# EAGLE design CC3D_micro (EAGLE 6.4)
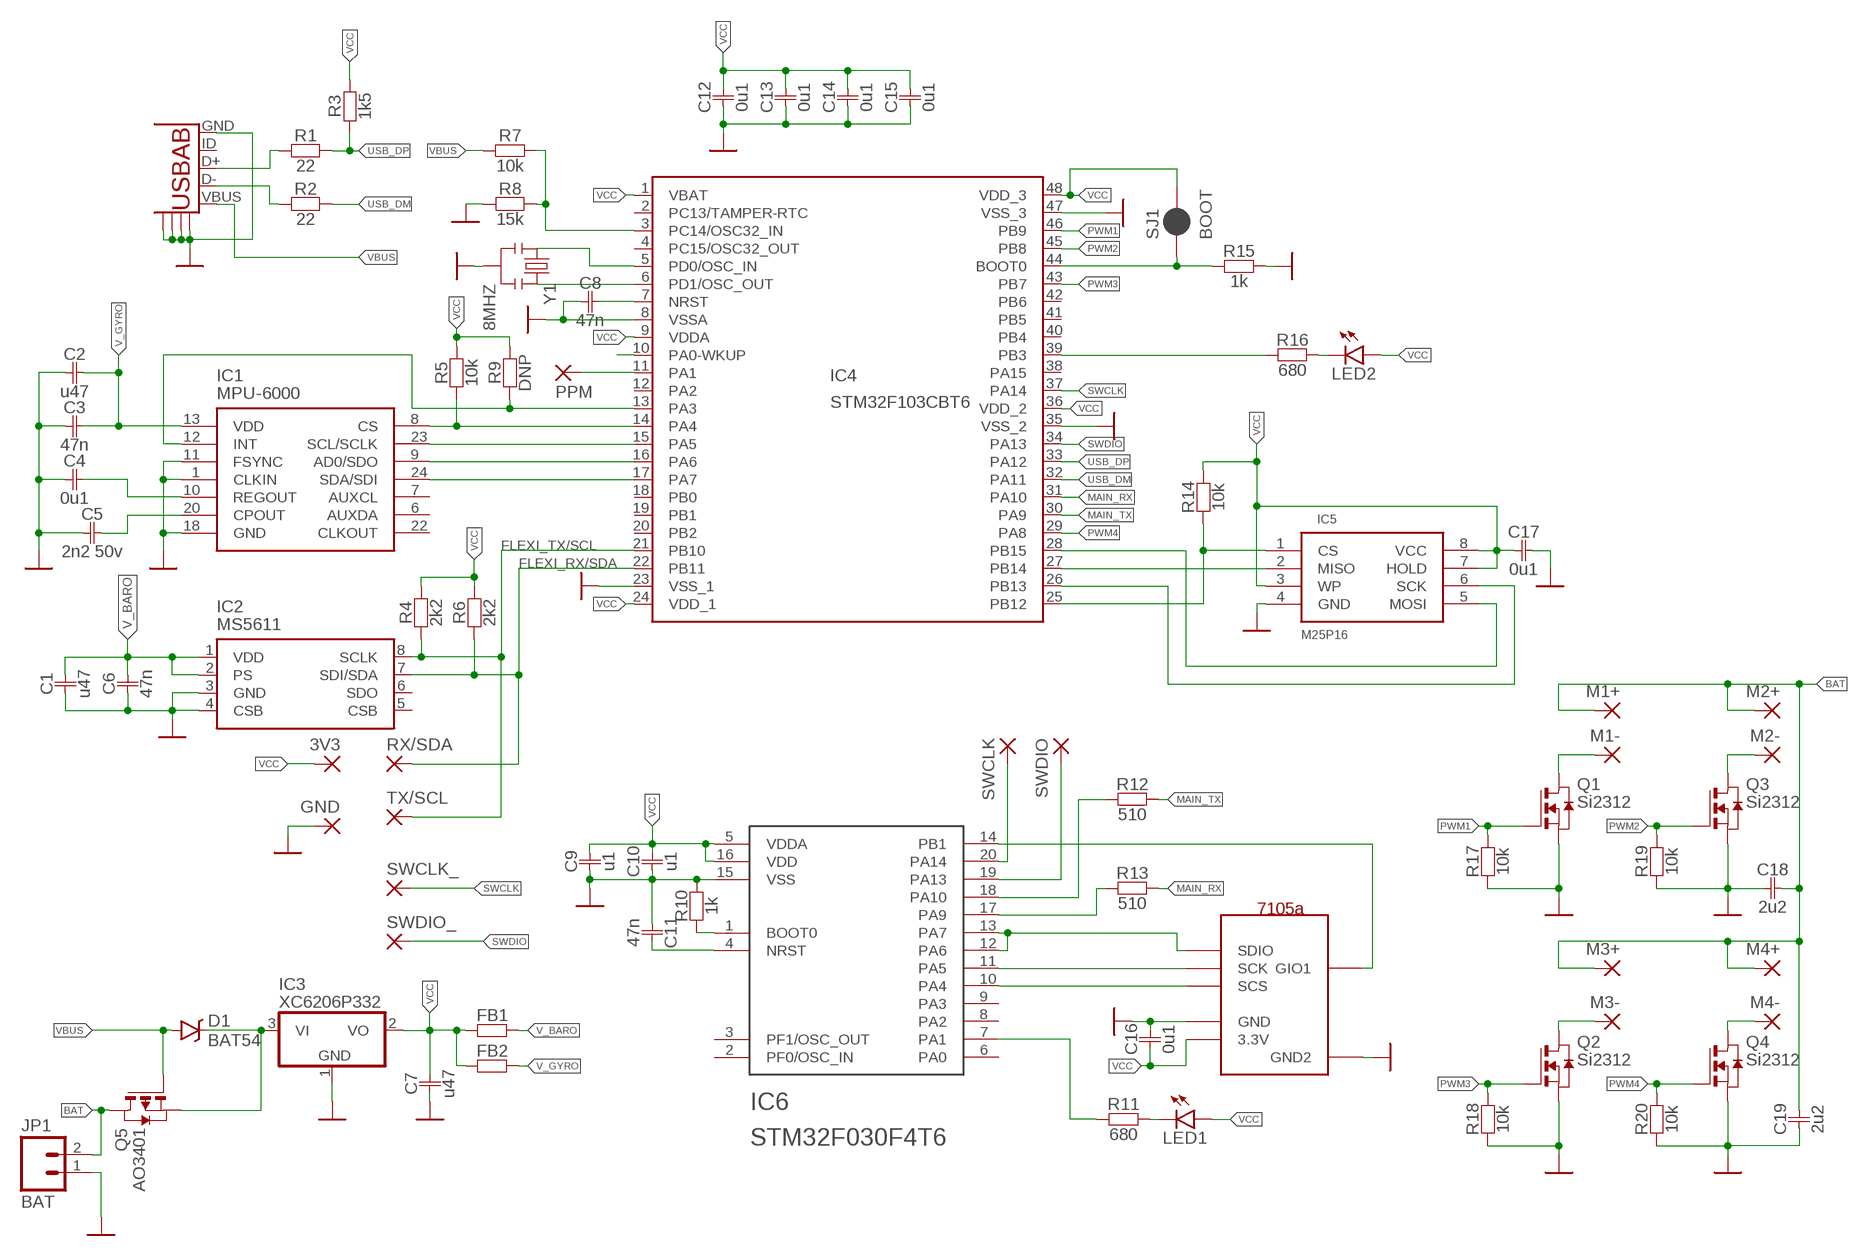
[diagram p0: schematic, sheet 1]

## Parts
3V3  SMD2  [SMD1,27-2,54]
C1  u47  C0402  [0402]
C2  u47  C0402  [0402]
C3  47n  C0402  [0402]
C4  0u1  C0402  [0402]
C5  2n2 50v  C0402  [0402]
C6  47n  C0402  [0402]
C7  u47  C0805  [0805]
C8  47n  C0402  [0402]
C9  u1  C0402  [0402]
C10  u1  C0402  [0402]
C11  47n  C0402  [0402]
C12  0u1  C0402  [0402]
C13  0u1  C0402  [0402]
C14  0u1  C0402  [0402]
C15  0u1  C0402  [0402]
C16  0u1  C0603  [0603]
C17  0u1  C0402  [0402]
C18  2u2  C0805  [0805]
C19  2u2  C0805  [0805]
D1  BAT54  BAT20JFILM  [SOD-323]
FB1  R0603  [0603]
FB2  R0603  [0603]
GND  SMD2  [SMD1,27-2,54]
IC1  MPU-6000  MPU-6050  [QFN-24-TESTING]
IC2  MS5611  [LGA8]
IC3  XC6206P332  MCP1703CB  [SOT23]
IC4  STM32F103CBT6  STM32F103C8  [LQFP48]
IC5  M25P16  SPI_FLASH-X25XXSMD  [SO08]
IC6  STM32F030F4T6  STM32F030XTSSOP20  [TSSOP-20]
JP1  BAT  M021X02_NO_SILK  [1X02_NO_SILK]
LED1  LED0603  [LED-0603]
LED2  LED0603  [LED-0603]
M1+  SMD2  [SMD1,27-2,54]
M1-  SMD2  [SMD1,27-2,54]
M2+  SMD2  [SMD1,27-2,54]
M2-  SMD2  [SMD1,27-2,54]
M3+  SMD2  [SMD1,27-2,54]
M3-  SMD2  [SMD1,27-2,54]
M4+  SMD2  [SMD1,27-2,54]
M4-  SMD2  [SMD1,27-2,54]
PPM  SMD2  [SMD1,27-2,54]
Q1  Si2312  NMOSSOT23  [SOT-23]
Q2  Si2312  NMOSSOT23  [SOT-23]
Q3  Si2312  NMOSSOT23  [SOT-23]
Q4  Si2312  NMOSSOT23  [SOT-23]
Q5  AO3401  PMOSSOT23  [SOT-23]
R1  22  R0402  [0402]
R2  22  R0402  [0402]
R3  1k5  R0402  [0402]
R4  2k2  R0402  [0402]
R5  10k  R0402  [0402]
R6  2k2  R0402  [0402]
R7  10k  R0402  [0402]
R8  15k  R0402  [0402]
R9  DNP  R0402  [0402]
R10  1k  R0402  [0402]
R11  680  R0402  [0402]
R12  510  R0402  [0402]
R13  510  R0402  [0402]
R14  10k  R0402  [0402]
R15  1k  R0402  [0402]
R16  680  R0402  [0402]
R17  10k  R0402  [0402]
R18  10k  R0402  [0402]
R19  10k  R0402  [0402]
R20  10k  R0402  [0402]
RX/SDA  SMD2  [SMD1,27-2,54]
SJ1  BOOT  JUMPER-PAD-2-NC_BY_PASTE  [PAD-JUMPER-2-NC_BY_PASTE_YES_SILK]
SWCLK  SMD2  [SMD1,27-2,54]
SWCLK_  SMD2  [SMD1,27-2,54]
SWDIO  SMD2  [SMD1,27-2,54]
SWDIO_  SMD2  [SMD1,27-2,54]
TX/SCL  SMD2  [SMD1,27-2,54]
U$1  microUSB  UNTITLED_USB_AB  [UNTITLED_USB-AB-MICRO-SMD]
U$2  XL7105-SL-B-TH  [XL7105-SY-B]
Y1  8MHZ  RESONATOR8MHZ  [RESONATOR-SMD]

## Nets
BAT: C18.P$2 C19.P$2 JP1.2 M1+.1(P) M2+.1(P) M3+.1(P) M4+.1(P) Q5.1(D)
FLEXI_RX/SDA: IC2.7(SDI/SDA) IC4.22(PB11) R6.P$1 RX/SDA.1(P)
FLEXI_TX/SCL: IC2.8(SCLK) IC4.21(PB10) R4.P$1 TX/SCL.1(P)
GND: C1.P$1 C2.P$1 C3.P$1 C4.P$1 C5.P$1 C6.P$1 C7.P$1 C8.P$1 C9.P$1 C10.P$2 C11.P$1 C12.P$1 C13.P$1 C14.P$1 C15.P$1 C16.P$2 C17.P$2 C18.P$1 C19.P$1 GND.1(P) IC1.1(CLKIN) IC1.11(FSYNC) IC1.18(GND) IC2.3(GND) IC2.4(CSB) IC3.1(GND) IC4.8(VSSA) IC4.23(VSS_1) IC4.35(VSS_2) IC4.47(VSS_3) IC5.4(GND) IC6.15(VSS) JP1.1 Q1.2(S) Q2.2(S) Q3.2(S) Q4.2(S) R8.P$2 R10.P$2 R15.P$2 R17.P$1 R18.P$1 R19.P$1 R20.P$1 U$1.GND U$1.GND@1 U$1.GND@2 U$1.GND@3 U$1.GND@4 U$2.P$2(GND) U$2.P$6(GND2) Y1.2
M1+: M1-.1(P) Q1.1(D)
M2+: M2-.1(P) Q3.1(D)
M3+: M3-.1(P) Q2.1(D)
M4+: M4-.1(P) Q4.1(D)
MAIN_RX: IC4.31(PA10) R13.P$2
MAIN_TX: IC4.30(PA9) R12.P$2
N$1: IC1.12(INT) IC4.13(PA3) R9.P$1
N$2: IC1.8(CS) IC4.14(PA4) R5.P$1
N$3: IC1.23(SCL/SCLK) IC4.15(PA5)
N$4: IC1.9(AD0/SDO) IC4.16(PA6)
N$5: IC1.24(SDA/SDI) IC4.17(PA7)
N$6: IC4.10(PA0-WKUP)
N$7: IC6.1(BOOT0) R10.P$1
N$9: IC4.25(PB12) IC5.1(CS) R14.P$1
N$10: IC4.26(PB13) IC5.6(SCK)
N$11: IC4.27(PB14) IC5.2(MISO)
N$12: IC4.28(PB15) IC5.5(MOSI)
N$13: IC4.6(PD1/OSC_OUT) Y1.3
N$14: IC6.14(PB1) U$2.P$7(GIO1)
N$15: IC4.39(PB3) R16.P$1
N$16: LED2.C R16.P$2
N$17: IC4.3(PC14/OSC32_IN) R7.P$2 R8.P$1
N$18: R2.P$2 U$1.D-
N$19: IC4.44(BOOT0) R15.P$1 SJ1.1
N$20: R1.P$2 U$1.D+
N$21: IC6.10(PA4) U$2.P$3(SCS)
N$22: IC6.11(PA5) U$2.P$4(SCK)
N$24: LED1.C R11.P$2
N$25: IC6.12(PA6) IC6.13(PA7) U$2.P$5(SDIO)
N$26: IC6.17(PA9) R13.P$1
N$27: IC6.18(PA10) R12.P$1
N$29: IC6.19(PA13) SWDIO.1(P)
N$30: IC6.20(PA14) SWCLK.1(P)
N$31: IC6.7(PA1) R11.P$1
N$32: C4.P$2 IC1.10(REGOUT)
N$33: IC4.5(PD0/OSC_IN) Y1.1
N$34: C5.P$2 IC1.20(CPOUT)
N$35: IC4.11(PA1) PPM.1(P)
N$36: D1.C IC3.3(VI) Q5.2(S)
N$37: C8.P$2 IC4.7(NRST)
N$38: C11.P$2 IC6.4(NRST)
PWM1: IC4.46(PB9) Q1.3(G) R17.P$2
PWM2: IC4.45(PB8) Q3.3(G) R19.P$2
PWM3: IC4.43(PB7) Q2.3(G) R18.P$2
PWM4: IC4.29(PA8) Q4.3(G) R20.P$2
SWCLK: IC4.37(PA14) SWCLK_.1(P)
SWDIO: IC4.34(PA13) SWDIO_.1(P)
USB_DM: IC4.32(PA11) R2.P$1
USB_DP: IC4.33(PA12) R1.P$1 R3.P$2
V_BARO: C1.P$2 C6.P$2 FB1.P$2 IC2.1(VDD) IC2.2(PS)
V_GYRO: C2.P$2 C3.P$2 FB2.P$2 IC1.13(VDD)
VBUS: D1.A Q5.3(G) R7.P$1 U$1.VBUS
VCC: 3V3.1(P) C7.P$2 C9.P$2 C10.P$1 C12.P$2 C13.P$2 C14.P$2 C15.P$2 C16.P$1 C17.P$1 FB1.P$1 FB2.P$1 IC3.2(VO) IC4.1(VBAT) IC4.9(VDDA) IC4.24(VDD_1) IC4.36(VDD_2) IC4.48(VDD_3) IC5.3(WP) IC5.7(HOLD) IC5.8(VCC) IC6.5(VDDA) IC6.16(VDD) LED1.A LED2.A R3.P$1 R4.P$2 R5.P$2 R6.P$2 R9.P$2 R14.P$2 SJ1.2 U$2.P$1(3.3V)
Unconnected: IC1.6(AUXDA) IC1.7(AUXCL) IC1.22(CLKOUT) IC2.5(CSB) IC2.6(SDO) IC4.2(PC13/TAMPER-RTC) IC4.4(PC15/OSC32_OUT) IC4.12(PA2) IC4.18(PB0) IC4.19(PB1) IC4.20(PB2) IC4.38(PA15) IC4.40(PB4) IC4.41(PB5) IC4.42(PB6) IC6.2(PF0/OSC_IN) IC6.3(PF1/OSC_OUT) IC6.6(PA0) IC6.8(PA2) IC6.9(PA3) U$1.ID(USBID)

## Library data of the parts
3V3 GND M1+ M1- M2+ M2- M3+ M3- M4+ M4- PPM RX/SDA SWCLK SWCLK_ SWDIO SWDIO_ TX/SCL = cc3d:SMD2: SMD PAD
C1-C19 = RC.v2:C
D1 = SparkFun-DiscreteSemi:BAT20JFILM: 23V, 1A Schottky diode, SOD-323 package; PROD_ID: DIO-11623; VALUE: BAT20JFILM
FB1 FB2 R1-R20 = RC.v2:R
IC1 = cc3d:MPU-6050: MPU-6000 - I2C address is 0x68 with AD0 low and 0x69 with AD0 high.
IC2 = cc3d:MS5611: edit this description Auto generated by make-symbol-device-package-bsdl.ulp Rev. 43 Source:
IC3 = semi:MCP1703: 250 mA, 16V, Low Quiescent Current LDO Regulator Source: http://ww1.microchip.com/downloads/en/DeviceDoc/22049b.pdf
IC4 = cc3d:STM32F103C8: STM32F103C8 edit this description Auto generated by make-symbol-device-package-bsdl.ulp Rev. 43 Source: STM32F103C8.txt
IC5 = cc3d:SPI_FLASH-X25XX: 8pin SPI Flash series x25xx. Works with devices like W25X32 and BR25L32
IC6 = stm32f030x:STM32F030X
JP1 = SparkFun-Connectors:M02: Standard 2-pin 0.1" header. Use with - straight break away headers ( PRT-00116) - right angle break away headers (PRT-00553) - swiss pins (PRT-00743) - machine pins (PRT-00117) - female headers (PRT-00115) Molex polarized connector foot print use with: PRT-08233 with associated crimp pins and housings. 2.54_SCREWTERM for use with PRT-10571. 3.5mm Screw Terminal footprints for PRT-08084 5mm Screw Terminal footprints for use with PRT-08432
LED1 LED2 = SparkFun-LED:LED: LEDs Standard schematic elements and footprints for 5mm, 3mm, 1206, and 0603 sized LEDs. 5mm - Spark Fun Electronics SKU : COM-00529 (and others)
Q1-Q4 = cc3d:NMOSSOT23: MOS FET; OC_FARNELL: unknown; OC_NEWARK: unknown
Q5 = cc3d:PMOSSOT23: MOS FET; OC_FARNELL: unknown; OC_NEWARK: unknown
SJ1 = SparkFun-Passives:JUMPER-PAD-2-NC_BY_PASTE
U$1 = cc3d:UNTITLED_USB_AB: This is a USB AB connector that is compatible with USB OTG. i.e. this connector can serve as a host or device
U$2 = xl7105:XL7105-SL-B
Y1 = cc3d:RESONATOR: Resonator Small SMD resonator. Used, eg, on the Arduino Pro/ Pro Mini boards. 8MHz- XTAL-08895 16MHz- XTAL-08900; PROD_ID: XTAL-08895

## Board
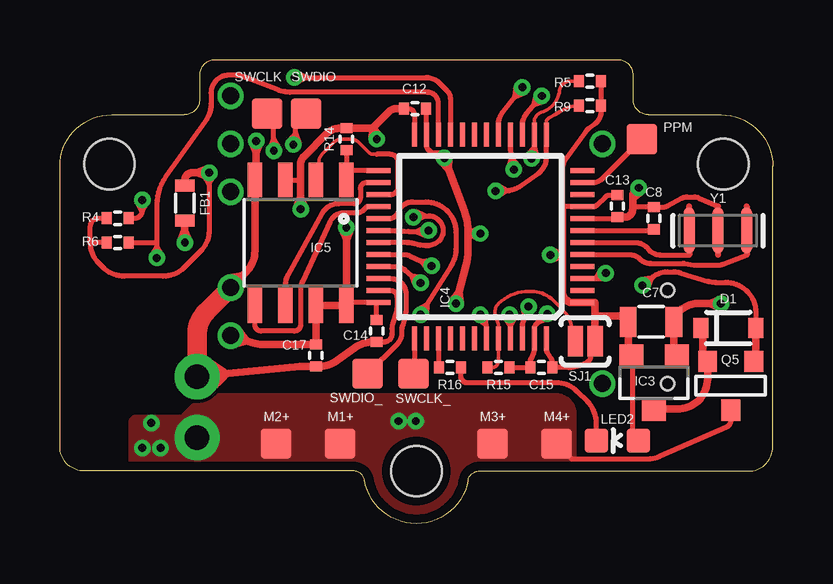
[diagram p1: board, top side]
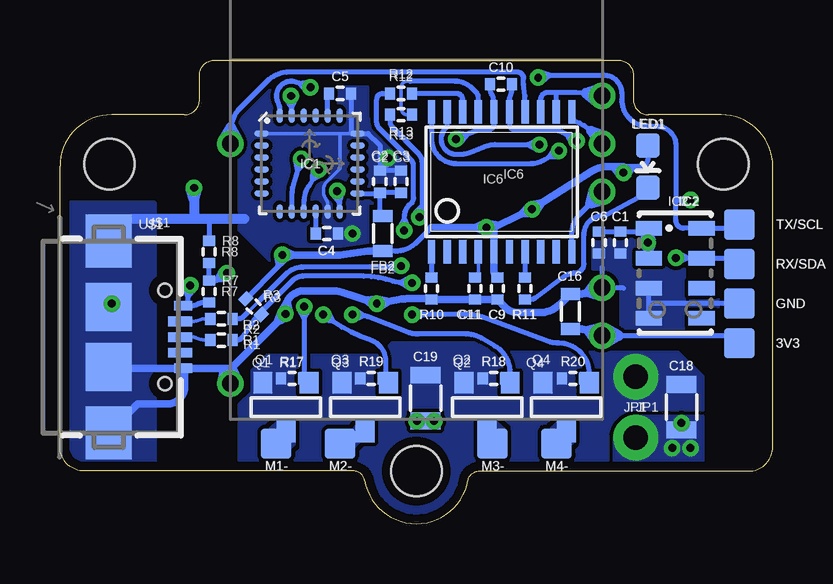
[diagram p2: board, bottom side, seen from below]

Size 29.72 x 19.34 mm. Coordinates in mm from the lower left corner, seen from the top.
Outline: 24.54,17.05 arc-90 23.9,17.69 23.9,18.7 arc90 23.27,19.34 6.45,19.34 arc90 5.82,18.7 5.82,17.69 arc-90 5.18,17.05 2.15,17.05 arc90 0,14.9 0,3.21 arc90 1.02,2.19 12.19,2.19 arc-86 12.7,1.81 arc160 17.02,1.81 arc-86 17.53,2.19 28.7,2.19 arc90 29.72,3.21 29.72,14.9 arc90 27.57,17.05 24.54,17.05
Copper layers (1*16): Top 0.0356mm / dielectric 1.5011mm / Bottom 0.0356mm
Design rules "oshpark-2layer": minimum track width 6mil, minimum drill 13mil, track to track 6mil, track to pad 6mil, pad to pad 6mil, via to via 6mil, smd to smd 6mil, copper to edge 15mil, drill to drill 6mil, minimum pad ring 7mil, minimum via ring 7mil, stop-mask expansion 0mil, vias tented up to drill 30mil, thermal gap 10mil
Holes 2.1 mm at 2.06,14.99 27.66,14.99 14.86,2.19
bRestrict: 2 lines

### Footprints (pad centres in the part's own frame; a part is rotated, then mirrored left to right if it is on the bottom)
SMD1,27-2,54 = smd 1.27 x 1.27: 1 0,0
0402 = smd 0.42 x 0.5: P$1 -0.46,0; P$2 0.46,0
0805 = smd 0.7 x 1.25: P$1 -0.95,0; P$2 0.95,0
0603 = smd 0.5 x 0.8: P$1 -0.735,0; P$2 0.735,0
SOD-323 = smd 0.63 x 0.83: A 1.15,0; C -1.15,0
QFN-24-TESTING = smd 0.61 x 0.254: 1 -2,1.25; 2 -2,0.75; 3 -2,0.25; 4 -2,-0.25; 5 -2,-0.75; 6 -2,-1.25; 13 2,-1.25; 14 2,-0.75; 15 2,-0.25; 16 2,0.25; 17 2,0.75; 18 2,1.25 | smd 0.254 x 0.61: 7 -1.25,-2; 8 -0.75,-2; 9 -0.25,-2; 10 0.25,-2; 11 0.75,-2; 12 1.25,-2; 19 1.25,2; 20 0.75,2; 21 0.25,2; 22 -0.25,2; 23 -0.75,2; 24 -1.25,2
LGA8 = smd 1.1 x 0.6: 1 -1.1,1.875; 2 -1.1,0.625; 3 -1.1,-0.625; 4 -1.1,-1.875; 5 1.1,-1.875; 6 1.1,-0.625; 7 1.1,0.625; 8 1.1,1.875
SOT23 = smd 1 x 1: 1 -0.95,-1.1; 2 0.95,-1.1; 3 0,1.1
LQFP48 = smd 0.2 x 1: 1 -2.75,-4.25; 2 -2.25,-4.25; 3 -1.75,-4.25; 4 -1.25,-4.25; 5 -0.75,-4.25; 6 -0.25,-4.25; 7 0.25,-4.25; 8 0.75,-4.25; 9 1.25,-4.25; 10 1.75,-4.25; 11 2.25,-4.25; 12 2.75,-4.25; 25 2.75,4.25; 26 2.25,4.25; 27 1.75,4.25; 28 1.25,4.25; 29 0.75,4.25; 30 0.25,4.25; 31 -0.25,4.25; 32 -0.75,4.25; 33 -1.25,4.25; 34 -1.75,4.25; 35 -2.25,4.25; 36 -2.75,4.25 | smd 1 x 0.2: 13 4.25,-2.75; 14 4.25,-2.25; 15 4.25,-1.75; 16 4.25,-1.25; 17 4.25,-0.75; 18 4.25,-0.25; 19 4.25,0.25; 20 4.25,0.75; 21 4.25,1.25; 22 4.25,1.75; 23 4.25,2.25; 24 4.25,2.75; 37 -4.25,2.75; 38 -4.25,2.25; 39 -4.25,1.75; 40 -4.25,1.25; 41 -4.25,0.75; 42 -4.25,0.25; 43 -4.25,-0.25; 44 -4.25,-0.75; 45 -4.25,-1.25; 46 -4.25,-1.75; 47 -4.25,-2.25; 48 -4.25,-2.75
SO08 = smd 0.61 x 1.448: 1 -1.905,-2.616; 2 -0.635,-2.616; 3 0.635,-2.616; 4 1.905,-2.616; 5 1.905,2.616; 6 0.635,2.616; 7 -0.635,2.616; 8 -1.905,2.616
TSSOP-20 = smd 0.305 x 0.991: 1 -2.925,-2.918; 2 -2.275,-2.918; 3 -1.625,-2.918; 4 -0.975,-2.918; 5 -0.325,-2.918; 6 0.325,-2.918; 7 0.975,-2.918; 8 1.625,-2.918; 9 2.275,-2.918; 10 2.925,-2.918; 11 2.925,2.918; 12 2.275,2.918; 13 1.625,2.918; 14 0.975,2.918; 15 0.325,2.918; 16 -0.325,2.918; 17 -0.975,2.918; 18 -1.625,2.918; 19 -2.275,2.918; 20 -2.925,2.918
1X02_NO_SILK = drill 1.016 pad 1.88: 1 0,0; 2 2.54,0
LED-0603 = smd 1 x 1: A 0,-0.877; C 0,0.877
SOT-23 = smd 0.787 x 0.889: 1 0.025,-1.016; 2 -0.94,1.016; 3 0.991,1.016
PAD-JUMPER-2-NC_BY_PASTE_YES_SILK = smd 0.635 x 1.27: 1 -0.401,0; 2 0.413,0
UNTITLED_USB-AB-MICRO-SMD = smd 1 x 0.4: D+ 2.469,0; D- 2.469,0.65; ID 2.469,-0.65 | smd 0.746 x 0.4: GND 2.596,-1.3; VBUS 2.596,1.3 | smd 1.9 x 2.2: GND@1 -0.508,4; GND@4 -0.508,-4 | smd 1.9 x 2: GND@2 -0.508,1.25; GND@3 -0.508,-1.25 | hole 0.55: 1.84,1.95; 1.84,-1.95
XL7105-SY-B = drill 0.7 pad 1.1: P$1 8,-4; P$2 8,-2; P$3 8,2; P$4 8,4; P$5 8,6; P$6 -7.5,-6; P$7 -7.5,4
RESONATOR-SMD = smd 0.45 x 1.905: 1 -1.2,0; 2 0,0; 3 1.2,0

### Placement (x,y rotation side)
3V3  1.4,7.53 90 bottom
C1  6.35,11.72 90 bottom
C2  16.38,14.26 270 bottom
C3  15.49,14.26 270 bottom
C4  18.59,12.1 180 bottom
C5  18.03,17.94 180 bottom
C6  7.24,11.72 90 bottom
C7  24.64,8.42 180 top
C8  24.77,12.73 270 top
C9  11.48,9.81 90 bottom
C10  11.33,18.32 0 bottom
C11  12.42,9.81 90 bottom
C12  14.81,17.31 180 top
C13  23.24,13.24 90 top
C14  13.21,8.03 90 top
C15  20.07,6.51 0 top
C16  8.43,8.85 90 bottom
C17  10.67,7.02 270 top
C18  3.81,4.86 270 bottom
C19  14.48,5.24 270 bottom
D1  27.86,8.16 0 top
FB1  5.21,13.37 270 top
FB2  16.26,12.1 90 bottom
GND  1.4,9.18 90 bottom
IC1  19.3,15.02 0 bottom
IC2  4.06,10.45 0 bottom
IC3  24.77,5.88 180 top
IC4  17.53,11.97 90 top
IC5  10.03,11.72 180 top
IC6  11.3,14.26 0 bottom
JP1  5.71,6.13 270 bottom
LED1  5.21,14.89 180 bottom
LED2  23.24,3.46 90 top
M1+  11.68,3.34 180 top
M1-  20.7,3.34 270 bottom
M2+  9.02,3.34 0 top
M2-  18.03,3.34 0 bottom
M3+  18.03,3.34 90 top
M3-  11.68,3.34 180 bottom
M4+  20.7,3.34 0 top
M4-  9.02,3.34 0 bottom
PPM  24.26,16.04 0 top
Q1  20.32,4.86 0 bottom
Q2  11.94,4.86 0 bottom
Q3  17.02,4.86 0 bottom
Q4  8.64,4.86 0 bottom
Q5  27.94,5.75 0 top
R1  22.99,7.65 180 bottom
R2  22.99,8.54 180 bottom
R3  21.64,9.05 315 bottom
R4  2.41,12.73 180 top
R5  22.1,18.45 0 top
R6  2.41,11.72 180 top
R7  23.49,9.69 90 bottom
R8  23.49,11.34 90 bottom
R9  22.1,17.43 0 top
R10  14.22,9.81 270 bottom
R11  10.34,9.81 270 bottom
R12  15.49,17.94 180 bottom
R13  15.49,17.05 180 bottom
R14  11.94,16.04 90 top
R15  18.29,6.51 0 top
R16  16.26,6.51 0 top
R17  20.04,6.05 0 bottom
R18  11.63,6.05 0 bottom
R19  16.74,6.05 0 bottom
R20  8.33,6.05 0 bottom
RX/SDA  1.4,10.83 90 bottom
SJ1  21.89,7.6 0 top
SWCLK  8.64,17.1 90 top
SWCLK_  14.73,6.26 0 top
SWDIO  10.26,17.1 90 top
SWDIO_  12.83,6.26 0 top
TX/SCL  1.4,12.48 90 bottom
U$1  27.18,7.78 0 bottom
U$2  15.11,11.84 0 bottom
Y1  27.43,12.23 180 top

### Tracks (layer width: path | path; a pad name or v marks a point on that pad's centre or on a via)
BAT  (via drill 0.33 pad 0.69)
  Top 0.203: M4+.1 21.34,2.7 24.5,2.7 arc24 25.01,2.81 27.78,4.02 arc67 27.97,4.31 Q5.1
  Bottom 0.152: v14.83,4.28 14.62,4.28 | 14.62,4.28 C19.P$2 | 14.62,4.28 14.26,4.5 v14.12,4.28 14.27,4.05 14.62,4.28
  other vias: 3.43,3.16 4.19,3.16 3.81,4.2
  pour Bottom (no thermals): 5.71,4.48 2.92,4.48 2.92,2.32 6.6,2.32 6.6,3.59
  pour Top (rank 2, no thermals): 21.46,2.19 21.46,4.61 arc90 20.7,5.37 5.97,5.37 5.08,4.48 3.18,4.48 arc90 2.92,4.22 2.92,2.19 11.68,2.19 13.84,0.03 15.88,0.03 18.03,2.19
FLEXI_RX/SDA  (via drill 0.33 pad 0.69)
  Top 0.203: IC4.22 15.78,17.53 arc90 15.32,17.99 9.58,17.99 arc-21 9.13,18.08 7.71,18.62 arc21 7.26,18.7 7.04,18.7 arc90 6.3,17.97 6.3,17.51 arc-36 6.06,16.77 4.41,14.48 arc36 4.04,13.31 4.04,11.72 | R6.P$1 4.04,11.72 | 4.04,11.72 4.04,11.58 | 4.04,11.58 v4.04,11.08 | 4.04,11.58 3.83,11.2 v4.04,11.08 | 4.04,11.58 4.25,11.2 v4.04,11.08
  Bottom 0.203: RX/SDA.1 1.64,11.07 IC2.7 3.54,11.07 | 3.54,11.07 v4.03,11.07 v4.04,11.08 | 3.54,11.07 3.93,10.87 v4.04,11.08 | 3.54,11.07 3.92,11.29 v4.04,11.08
FLEXI_TX/SCL  (via drill 0.33, 0.33 pad 0.69)
  Top 0.203: v9.78,18.6 10.27,18.6 | 10.27,18.6 15.28,18.6 arc-45 15.82,18.38 16.14,18.05 arc-45 16.28,17.73 IC4.21 | R4.P$1 3.11,12.73 arc81 3.43,13 | 3.43,13 arc9 3.43,13.05 v3.43,13.5 | 10.27,18.6 9.9,18.81 v9.78,18.6 | 10.27,18.6 9.9,18.39 v9.78,18.6 | 3.43,13 3.64,13.38 v3.43,13.5 | 3.43,13 3.22,13.38 v3.43,13.5
  Bottom 0.203: v9.78,18.6 9.75,18.6 9.65,18.7 9.29,18.7 | 9.29,18.7 7.04,18.7 arc90 6.3,17.97 6.3,17.69 arc-91 5.16,16.57 4.83,16.57 arc90 4.04,15.78 4.04,13.5 | 4.04,13.5 4.04,12.64 arc-90 3.72,12.32 IC2.8 1.55,12.32 TX/SCL.1 | 4.04,13.5 3.92,13.5 | 3.92,13.5 v3.43,13.5 | 9.29,18.7 9.62,18.42 v9.78,18.6 | 9.29,18.7 9.71,18.83 v9.78,18.6 | 3.92,13.5 3.55,13.71 v3.43,13.5 | 3.92,13.5 3.55,13.28 v3.43,13.5
GND  (via drill 0.33 pad 0.69)
  Top 0.203: C12.P$1 IC4.23 15.28,15.78 arc64 15.42,15.55 15.58,15.47 | 8.18,14.33 IC5.4 | IC4.35 13.79,9.72 arc-90 14.05,9.47 14.05,8.97 arc-18 14.02,8.78 13.87,8.33 arc18 13.84,8.14 13.84,7.91 arc-45 13.75,7.69 13.73,7.67 arc-45 13.5,7.57 C14.P$1 | R15.P$2 C15.P$1 19.61,6.74 arc-24 19.63,6.88 19.75,7.12 arc24 19.78,7.25 IC4.47 19.78,8.11 arc-48 19.88,8.35 19.95,8.41 | IC4.8 23.37,12.72 C13.P$1 | 19.95,8.41 v20.32,8.75 | 15.58,15.47 v16.03,15.25 | 27.43,13.24 26.63,13.59 arc23 26.45,13.62 26.15,13.62 arc28 25.94,13.57 25.32,13.25 arc-28 25.11,13.19 C8.P$1 23.92,13.19 23.88,13.24 | 19.95,8.41 20.32,8.56 v20.32,8.75 | 19.95,8.41 20.09,8.82 v20.32,8.75 | 15.58,15.47 15.83,15.11 v16.03,15.25 | 15.58,15.47 16.02,15.46 v16.03,15.25
  Top 0.305: v8.18,15.96 8.18,15.46 | 8.18,15.46 8.18,14.33 | IC5.4 8.13,11.39 arc-45 7.76,10.49 7.61,10.34 | 7.61,10.34 U$2.P$2 | C13.P$1 23.56,12.78 arc90 23.88,13.1 23.88,13.24 23.88,13.58 | 23.88,13.58 23.88,13.75 v24.13,14 | IC3.1 25.59,6.98 C7.P$1 25.59,8.6 25.87,8.88 arc-45 26.58,9.18 27.06,9.18 | v16.51,9.18 16.93,10.77 arc15 17.02,11.41 17.02,12.1 | 17.02,12.1 17.02,12.15 arc21 16.86,13.03 v16.03,15.25 | 17.02,12.1 17.03,12.1 | 17.03,12.1 v17.53,12.1 | 27.06,9.18 v27.56,9.18 | C14.P$1 13.03,7.57 arc36 12.29,7.33 11.56,6.8 arc-36 10.81,6.56 C17.P$2 10.14,6.56 arc6 10.02,6.55 JP1.1 | 8.18,15.46 8.33,15.89 v8.18,15.96 | 8.18,15.46 8,15.89 v8.18,15.96 | 23.88,13.58 24.24,13.85 v24.13,14 | 23.88,13.58 23.94,14.03 v24.13,14 | v16.03,15.25 16.22,15.24 16.2,14.78 15.89,15.12 v16.03,15.25 | v16.51,9.18 16.36,9.29 16.64,9.66 16.7,9.2 v16.51,9.18 | 17.03,12.1 17.45,11.92 v17.53,12.1 | 17.03,12.1 17.45,12.27 v17.53,12.1 | 27.06,9.18 27.49,9 v27.56,9.18 | 27.06,9.18 27.49,9.35 v27.56,9.18 | 7.61,10.34 7.04,10.24 U$2.P$2 | 7.61,10.34 7.5,9.77 U$2.P$2
  Top 0.61: 6.73,6.23 6.06,6.66 JP1.1 6.16,5.67 6.73,6.23
  Top 0.813: JP1.1 5.71,7.92 arc-45 6.09,8.82 U$2.P$2
  Bottom 0.152: 17.57,16.27 18.03,16.27 | 18.03,16.27 18.03,14.82 18.57,14.28 arc-73 18.67,13.6 18.55,13.41 IC1.11 | IC1.1 18.03,16.27
  Bottom 0.203: 8.59,16.23 8.64,16.26 arc-33 9.18,16.42 10.72,16.42 arc90 10.98,16.67 IC6.15 10.98,17.63 arc23 10.93,17.88 10.92,17.9 arc-23 10.87,18.15 C10.P$2 | 8.59,16.23 v8.18,15.96 | C5.P$1 17.57,16.27 IC1.18 16.87,16.27 16.38,15.78 C2.P$1 | C3.P$1 C2.P$1 | IC2.4 5.16,9.18 | 5.16,9.18 IC2.3 | GND.1 5.16,9.18 | 23.49,12.72 R8.P$2 | 7.11,10.7 U$2.P$2 6.26,9.84 6.22,9.81 | v16.03,15.25 16.08,15.02 16.28,14.82 | 16.28,14.82 C2.P$1 | 8.59,16.23 8.16,16.2 v8.18,15.96 | 8.59,16.23 8.39,15.85 v8.18,15.96 | 16.28,14.82 16.27,15.25 v16.03,15.25 | 16.28,14.82 15.91,15.04 v16.03,15.25
  Bottom 0.305: 7.78,9.62 arc18 8.01,9.58 C16.P$2 8.85,9.17 arc45 9.75,8.8 10.61,8.8 arc45 11.15,9.02 C9.P$1 C11.P$1 R10.P$2 14.23,9.38 15.26,9.38 arc-10 15.48,9.36 16.02,9.26 | 7.78,9.62 arc-1 7.76,9.62 U$2.P$2 | U$1.GND@3 27.69,6.48 U$1.GND 22.91,6.48 | 22.91,6.48 22.59,6.48 | 22.59,6.48 22.53,6.54 | 22.53,6.54 20.67,8.4 | 20.67,8.4 v20.32,8.75 | U$2.P$6 22.61,6.45 22.59,6.48 | U$1.GND@1 26.74,12.72 | v20.32,8.75 20.32,8.92 arc90 19.53,9.71 18.38,9.71 arc18 18,9.65 v16.51,9.18 | v27.56,9.18 27.54,9.18 U$1.GND@2 | U$1.GND@4 26.48,4.99 25.27,4.99 arc-90 24.51,5.75 24.51,6.51 | v16.51,9.18 16.02,9.26 | 20.67,8.4 20.5,8.82 v20.32,8.75 | 20.67,8.4 20.25,8.57 v20.32,8.75 | v20.32,8.75 20.14,8.8 20.25,9.24 20.48,8.84 v20.32,8.75 | v16.51,9.18 16.53,9.37 16.98,9.33 16.63,9.03 v16.51,9.18 | 16.02,9.26 16.41,9.02 v16.51,9.18 | 16.02,9.26 16.47,9.36 v16.51,9.18 | 22.91,6.48 22.41,6.19 U$2.P$6 | 22.91,6.48 23.01,5.91 U$2.P$6 | 22.53,6.54 22.26,6.03 U$2.P$6 | 22.53,6.54 22.91,6.11 U$2.P$6 | 7.78,9.62 7.43,10.08 U$2.P$2 | 7.78,9.62 7.22,9.46 U$2.P$2
  Bottom 0.406: 26.74,12.72 24.13,12.72 | 24.13,12.72 23.49,12.72 22.03,12.72 | v24.13,14 24.13,13.51 | 24.13,13.51 24.13,12.72 | 24.13,13.51 24.26,13.96 v24.13,14 | 24.13,13.51 24,13.96 v24.13,14 | U$2.P$2 6.81,10.02 | U$2.P$2 7.41,10.02 | U$2.P$2 6.94,9.54 | U$2.P$2 6.94,10.15
  pour Bottom (rank 2, no thermals): 2.92,4.73 5.71,4.73 6.86,3.59 6.86,2.32 6.99,2.19 11.68,2.19 14.1,-0.22 15.62,-0.22 18.03,2.19 22.23,2.19 22.23,4.99 21.72,5.49 21.72,6.38 21.08,7.02 16.38,7.02 15.88,7.53 11.68,7.53 11.3,7.15 3.94,7.15 2.92,6.13
  pour Bottom (no thermals): 16.89,18.19 20.83,18.19 22.23,16.8 22.23,12.23 20.95,10.96 16.89,10.96 16.89,13.37 14.99,13.37 14.99,15.02 16.89,16.92
  pour Bottom (no thermals): 2.29,12.99 7.49,12.99 7.49,10.63 7.09,10.63 arc90 6.32,9.86 6.32,8.03 2.29,8.03
  pour Bottom (no thermals): 30.61,13.37 25.78,13.37 25.78,2.32 30.61,2.32
M1+
  pour Bottom (no thermals): 20.95,3.95 20.68,4.22 19.96,4.22 19.96,3.31 20.12,3.16 20.95,3.16
M2+
  pour Bottom (no thermals): 18.16,3.89 17.53,3.89 17.32,4.1 16.69,4.1 16.69,3.49 17.17,3.49 17.45,3.21 18.16,3.21
M3+
  pour Bottom (no thermals): 12.24,4.2 11.51,4.2 11.15,3.89 11.15,3.21 12.24,3.21
M4+
  pour Bottom (no thermals): 8.97,4.22 9.32,3.89 9.5,3.89 9.5,3.18 8.53,3.18 8.31,3.41 8.31,4.22
MAIN_RX  (via drill 0.33 pad 0.69)
  Top 0.203: v14.73,12.78 14.78,12.84 15.22,12.84 | 15.22,12.84 15.37,12.84 arc-155 15.62,11.67 arc-26 15.24,11.59 arc-16 14.81,11.67 arc19 14.48,11.72 arc-2 IC4.31 | 15.22,12.84 14.83,13.01 v14.73,12.78 | 15.22,12.84 14.79,12.61 v14.73,12.78
  Bottom 0.203: R13.P$2 15.95,16.75 arc-45 15.86,16.53 14.79,15.46 arc45 14.61,15.01 14.61,13.26 | 14.61,13.26 14.61,12.78 v14.73,12.78 | 14.61,13.26 14.5,12.84 v14.73,12.78 | 14.61,13.26 14.91,12.95 v14.73,12.78
MAIN_TX  (via drill 0.33 pad 0.69)
  Top 0.203: IC4.30 13.97,12.22 arc-6 14.35,12.2 arc8 14.87,12.18 | 14.87,12.18 arc8 v15.37,12.23 | 14.87,12.18 15.27,12 v15.37,12.23 | 14.87,12.18 15.28,12.4 v15.37,12.23
  Bottom 0.203: R12.P$2 16.26,17.94 arc-90 16.51,17.69 16.51,16.73 arc-45 16.42,16.5 15.08,15.16 arc45 14.99,14.94 14.99,13.62 arc53 15.09,13.34 arc-53 15.37,12.81 15.37,12.72 | 15.37,12.72 v15.37,12.23 | 15.37,12.72 15.18,12.29 v15.37,12.23 | 15.37,12.72 15.58,12.34 v15.37,12.23
N$1  (via drill 0.33 pad 0.69)
  Top 0.152: IC4.13 20.28,16.72 arc-61 20.4,16.92 arc1 21.08,17.31 arc-33 R9.P$1
  Top 0.203: v18.16,13.88 18.51,13.88 arc36 19.25,14.12 19.96,14.62 arc54 20.28,15.24 IC4.13 | v18.16,13.88 18.27,14.09 18.66,13.88 18.28,13.67 v18.16,13.88
  Bottom 0.203: IC1.12 18.05,13.39 | 18.05,13.39 v18.16,13.88 | 18.05,13.39 18.34,13.72 v18.16,13.88 | 18.05,13.39 17.93,13.81 v18.16,13.88
N$2  (via drill 0.33 pad 0.69)
  Top 0.152: IC4.14 19.78,16.76 arc-73 20.07,17.15 arc66 20.83,18.07 arc-77 21.21,18.45 arc-13 R5.P$1
  Top 0.203: IC4.14 19.78,15.7 | 19.78,15.7 19.78,15.62 arc-30 v19.66,15.22 | 19.78,15.7 19.48,15.39 v19.66,15.22 | 19.78,15.7 19.89,15.29 v19.66,15.22
  Bottom 0.203: v19.66,15.22 19.8,14.75 | 19.8,14.75 20,14.12 arc-17 20.05,13.75 IC1.8 | 19.8,14.75 19.9,15.17 v19.66,15.22 | 19.8,14.75 19.49,15.05 v19.66,15.22
N$3  (via drill 0.33 pad 0.69)
  Top 0.203: IC4.15 19.28,16.59 arc-41 19.47,17.13 v20.09,17.84 | v20.09,17.84 20.17,17.61 19.77,17.46 19.86,17.89 v20.09,17.84
  Bottom 0.203: IC1.23 20.05,17.35 | 20.05,17.35 20.05,17.8 arc-90 v20.09,17.84 | 20.05,17.35 20.29,17.71 v20.09,17.84 | 20.05,17.35 19.87,17.74 v20.09,17.84
N$4  (via drill 0.33 pad 0.69)
  Top 0.203: IC4.16 18.78,15.67 arc11 18.8,15.43 v18.92,14.77 | v18.92,14.77 18.69,14.84 18.83,15.25 19.11,14.92 v18.92,14.77
  Bottom 0.203: v18.92,14.77 19.18,14.35 | 19.18,14.35 19.36,14.06 arc-32 19.55,13.39 IC1.9 | 19.18,14.35 19.16,14.78 v18.92,14.77 | 19.18,14.35 18.81,14.55 v18.92,14.77
N$5  (via drill 0.33 pad 0.69)
  Top 0.203: IC4.17 18.28,16.59 arc-39 18.49,17.21 18.97,17.81 | 18.97,17.81 v19.28,18.19 | 18.97,17.81 19.37,17.97 v19.28,18.19 | 18.97,17.81 19.04,18.23 v19.28,18.19
  Bottom 0.203: v19.28,18.19 19.74,18.36 | 19.74,18.36 19.84,18.4 arc-135 20.65,17.61 arc30 IC1.24 | 19.74,18.36 19.32,18.43 v19.28,18.19 | 19.74,18.36 19.46,18.04 v19.28,18.19
N$7
  Bottom 0.203: IC6.1 R10.P$1
N$9
  Top 0.203: IC4.25 11.94,14.72 IC5.1 R14.P$1
N$10
  Top 0.203: IC4.26 12.78,14.22 arc90 12.52,13.97 12.52,13.6 arc-90 12.27,13.34 11.63,13.34 arc61 10.92,12.93 9.5,10.38 arc29 9.4,9.98 IC5.6
N$11
  Top 0.152: IC5.2 10.67,14.38 10.79,14.51 10.79,15.08 arc-45 10.93,15.41 11.42,15.9 arc-45 11.75,16.04 12.13,16.04 arc-45 12.45,15.9 12.86,15.49 arc45 13.09,15.4 13.21,15.4
  Top 0.203: IC4.27 13.78,13.72 arc90 14.1,14.04 14.1,15.08 arc90 13.78,15.4 13.21,15.4
N$12
  Top 0.203: IC4.28 12.81,13.22 12.68,13.1 arc-45 12.36,12.96 11.84,12.96 arc65 11.26,12.59 10.11,10.1 arc25 10.03,9.76 10.03,8.29 arc-90 9.78,8.03 8.38,8.03 arc-90 8.13,8.29 IC5.5
N$13
  Top 0.203: IC4.6 23.99,11.72 arc-45 24.44,11.54 24.58,11.4 arc45 25.03,11.21 26.23,11.21
N$14
  Bottom 0.203: IC6.14 10.33,17.83 10.39,18.32 10.39,18.58 arc-90 10.64,18.83 20.18,18.83 arc-45 21.07,18.46 22.23,17.3 arc-45 22.61,16.4 U$2.P$7
  Bottom 0.406: 22.6,16.54 22.31,16.01 U$2.P$7 22.91,16.02 22.6,16.54
N$15
  Top 0.203: IC4.39 15.78,6.51 R16.P$1
N$16
  Top 0.203: LED2.C 22.36,4.19 arc45 21.99,5.09 21.58,5.5 arc45 20.68,5.88 16.97,5.88 arc-90 16.72,6.13 R16.P$2
N$17  (via drill 0.33 pad 0.69)
  Top 0.203: IC4.3 22.32,10.22 | 22.32,10.22 22.38,10.22 v22.76,10.45 | 22.32,10.22 22.75,10.21 v22.76,10.45 | 22.32,10.22 22.56,10.58 v22.76,10.45
  Bottom 0.203: R8.P$1 R7.P$2 23.23,10.15 arc-41 23.02,10.22 v22.76,10.45 | v22.76,10.45 22.98,10.55 23.16,10.15 22.73,10.21 v22.76,10.45
N$18
  Bottom 0.152: U$1.D- 24.21,8.43 arc-17 24.02,8.46 23.84,8.51 arc17 23.65,8.54 R2.P$2
N$19
  Top 0.152: R15.P$1 18.02,6.51 arc90 18.28,6.76 IC4.44 18.28,8.3 18.16,8.67 arc-63 18.29,9.18 arc-46 19.56,9.69 19.67,9.69 arc-45 20.57,9.31 20.96,8.91 arc-45 21.34,8.02 21.34,7.76 SJ1.1
N$20
  Bottom 0.152: R1.P$2 23.65,7.65 arc18 23.85,7.69 24.03,7.75 arc-18 24.23,7.78 U$1.D+
N$21
  Bottom 0.203: IC6.10 8.38,12.05 arc45 8.01,12.95 7.61,13.35 U$2.P$3
  Bottom 0.406: 7.61,13.35 7.45,13.94 U$2.P$3 7.02,13.51 7.61,13.35
N$22
  Bottom 0.203: IC6.11 8.38,16.85 8.25,16.8 arc35 U$2.P$4
  Bottom 0.406: 7.57,16.37 7,16.17 U$2.P$4 7.33,16.03 7.57,16.37
N$24
  Bottom 0.203: LED1.C 5.21,13.88 5.33,13.75 6.92,12.9 arc28 7.06,12.86 arc-90 7.87,12.05 7.87,10.83 arc90 8.25,10.45 arc-37 8.71,10.3 9.9,9.42 arc37 10.09,9.35 R11.P$2
N$25
  Bottom 0.203: IC6.13 9.68,17.67 arc90 9.36,17.99 9.03,17.99 | U$2.P$5 arc-15 8.2,17.99 9.02,17.99 9.03,17.99 | IC6.12 9.03,17.99
  Bottom 0.406: 7.8,17.97 7.23,18.17 U$2.P$5 7.34,17.58 7.8,17.97
N$26
  Bottom 0.152: R13.P$1 15.24,17.05 arc90 15.49,17.31 15.49,18.19 arc90 15.24,18.45 15.11,18.45
  Bottom 0.203: IC6.17 12.28,17.77 arc-45 12.37,17.99 12.53,18.16 arc-45 13.24,18.45 15.11,18.45
N$27
  Bottom 0.203: IC6.18 12.93,17.69 arc-90 13.18,17.94 R12.P$1
N$29  (via drill 0.33 pad 0.69)
  Top 0.203: v9.73,15.81 9.83,15.81 9.83,16.29 | 9.83,16.29 9.83,16.75 10.26,16.75 SWDIO.1 | 9.83,16.29 9.55,15.97 v9.73,15.81 | 9.83,16.29 9.96,15.88 v9.73,15.81
  Bottom 0.203: IC6.19 13.58,16.55 13.64,16.49 arc-133 13.21,15.4 13.02,15.4 arc-21 12.65,15.47 11.96,15.74 arc21 11.6,15.81 10.22,15.81 | 10.22,15.81 v9.73,15.81 | 10.22,15.81 9.85,16.02 v9.73,15.81 | 10.22,15.81 9.85,15.6 v9.73,15.81
N$30  (via drill 0.33 pad 0.69)
  Top 0.203: v8.91,15.55 8.91,16.05 | 8.91,16.05 8.91,16.77 SWCLK.1 | 8.91,16.05 8.73,15.62 v8.91,15.55 | 8.91,16.05 9.13,15.67 v8.91,15.55
  Bottom 0.203: IC6.20 14.23,16.04 arc-90 13.21,15.02 10.06,15.02 arc-32 9.54,15.17 9.34,15.29 | 9.34,15.29 v8.91,15.55 | 9.34,15.29 9.07,15.67 v8.91,15.55 | 9.34,15.29 8.91,15.31 v8.91,15.55
N$31
  Bottom 0.203: IC6.7 R11.P$1
N$32
  Bottom 0.203: IC1.10 19.05,12.05 C4.P$2
N$33
  Top 0.203: IC4.5 23.73,11.22 arc-45 24.17,11.04 arc45 24.62,10.85 25.97,10.85 arc-9 26.05,10.85 26.43,10.78 arc9 26.51,10.78 27.45,10.78 arc22 27.62,10.81 28.63,11.21
N$34
  Bottom 0.203: IC1.20 18.55,17.94 C5.P$2
N$35
  Top 0.203: IC4.11 22.18,14.22 arc45 22.63,14.41 PPM.1
N$36
  Top 0.305: D1.C 26.8,8.16 26.8,6.76 Q5.2 27,6.05 arc-90 25.73,4.78 IC3.3
N$37
  Top 0.203: IC4.7 24.64,12.22 C8.P$2
N$38
  Bottom 0.152: IC6.4 12.28,10.42 C11.P$2
PWM1  (via drill 0.33 pad 0.69)
  Top 0.203: IC4.46 19.28,8.21 arc-18 19.29,8.31 v19.53,9.05 | v19.53,9.05 19.7,8.87 19.38,8.58 19.32,9.03 v19.53,9.05
  Bottom 0.203: Q1.3 19.51,6.05 R17.P$2 19.53,6.1 19.53,8.56 | v19.53,9.05 19.53,8.56 | 19.53,8.56 19.74,8.93 v19.53,9.05 | 19.53,8.56 19.32,8.93 v19.53,9.05
PWM2  (via drill 0.33 pad 0.69)
  Top 0.203: IC4.45 18.78,8.23 | 18.78,8.23 18.78,8.65 v18.75,8.72 | 18.78,8.23 18.96,8.62 v18.75,8.72 | 18.78,8.23 18.54,8.59 v18.75,8.72
  Bottom 0.203: R19.P$2 16.1,5.88 Q3.3 16.13,5.88 16.13,6.76 arc-71 16.76,7.65 arc15 18.34,8.43 | 18.34,8.43 arc4 v18.75,8.72 | 18.34,8.43 18.77,8.48 v18.75,8.72 | 18.34,8.43 18.53,8.82 v18.75,8.72
PWM3  (via drill 0.33 pad 0.69)
  Top 0.203: IC4.43 17.78,8.21 arc30 17.73,8.37 v17.53,8.72 | v17.53,8.72 17.77,8.72 17.77,8.29 17.4,8.52 v17.53,8.72
  Bottom 0.203: v17.53,8.72 17.36,8.72 arc21 16.9,8.64 15.18,7.97 arc-18 14.78,7.91 12.79,7.91 arc30 12.15,7.74 11.58,7.41 arc60 10.95,6.31 Q2.3 11,5.88 R18.P$2 | v17.53,8.72 17.43,8.5 17.03,8.68 17.39,8.92 v17.53,8.72
PWM4  (via drill 0.33 pad 0.69)
  Top 0.203: IC4.29 13.72,12.72 arc70 14.1,12.99 arc-69 14.71,13.42 15.24,13.42 arc-90 16.51,12.15 16.51,11.45 arc-32 16.32,10.77 v15.04,8.72 | v15.04,8.72 14.92,8.93 15.3,9.14 15.28,8.71 v15.04,8.72
  Bottom 0.203: v15.04,8.72 12.81,8.72 arc20 11.94,8.56 9.36,7.6 arc-20 8.92,7.53 8.91,7.53 arc90 7.64,6.26 Q4.3 7.69,5.88 R20.P$2 | v15.04,8.72 14.92,8.51 14.54,8.72 14.92,8.93 v15.04,8.72
SWCLK
  Top 0.203: IC4.37 14.78,6.26 SWCLK_.1
SWDIO
  Top 0.203: IC4.34 13.79,10.22 arc-90 14.43,9.59 14.43,8.88 arc-16 14.4,8.71 14.27,8.25 arc16 14.25,8.07 14.25,7.94 arc-45 14.06,7.49 SWDIO_.1
USB_DM  (via drill 0.33 pad 0.69)
  Top 0.203: IC4.32 14.33,11.22 arc-25 14.59,11.16 15.04,10.96 | 15.04,10.96 v15.49,10.75 | 15.04,10.96 15.3,10.61 v15.49,10.75 | 15.04,10.96 15.47,10.99 v15.49,10.75
  Bottom 0.152: 21.39,9.3 21.89,8.8
  Bottom 0.203: v15.49,10.75 15.67,10.7 15.99,10.7 | 15.99,10.7 19.58,10.7 arc-45 20.28,10.41 21.39,9.3 | 21.89,8.8 22.06,8.64 arc45 22.28,8.54 R2.P$1 | 15.99,10.7 15.63,10.95 v15.49,10.75 | 15.99,10.7 15.59,10.53 v15.49,10.75
USB_DP  (via drill 0.33 pad 0.69)
  Top 0.203: IC4.33 13.98,10.72 arc-39 14.38,10.58 14.65,10.35 | 14.65,10.35 v15.04,10.04 | 14.65,10.35 14.81,9.95 v15.04,10.04 | 14.65,10.35 15.08,10.28 v15.04,10.04
  Bottom 0.203: 21.35,8.81 20.02,10.13 arc45 19.57,10.32 17.04,10.32 arc15 15.85,10.12 arc-17 15.34,10.04 v15.04,10.04 | R3.P$2 21.39,8.73 21.35,8.81 | R1.P$1 22.35,7.65 arc-53 22.1,7.78 arc-6 21.84,8.16 arc14 21.35,8.81 | v15.04,10.04 15.15,10.25 15.53,10.05 15.16,9.83 v15.04,10.04
V_BARO  (via drill 0.33 pad 0.69)
  Top 0.305: FB1.P$2 5.21,12.21 | 5.21,12.21 v5.21,11.72 | 5.21,12.21 5.03,11.79 v5.21,11.72 | 5.21,12.21 5.38,11.79 v5.21,11.72
  Bottom 0.203: C6.P$2 C1.P$2 5.39,12.18 | 5.39,12.18 5.31,12.18 5.28,12.21 | 5.28,12.21 IC2.1 5.16,12.21 | 5.16,12.21 5.16,11.7 | 5.16,11.7 5.16,11.22 | 5.16,11.22 IC2.2 | 5.16,11.7 5.21,11.7 v5.21,11.72 | 5.39,12.18 5.05,11.9 v5.21,11.72 | 5.39,12.18 5.45,11.75 v5.21,11.72 | 5.28,12.21 5.02,11.86 v5.21,11.72 | 5.28,12.21 5.43,11.8 v5.21,11.72 | 5.16,12.21 4.99,11.82 v5.21,11.72 | 5.16,12.21 5.41,11.85 v5.21,11.72 | 5.16,11.22 5.41,11.58 v5.21,11.72 | 5.16,11.22 4.99,11.62 v5.21,11.72
V_GYRO
  Bottom 0.203: C3.P$2 C2.P$2 | IC1.13 16.38,13.77 C2.P$2 | FB2.P$2 16.38,12.83 C2.P$2
VBUS  (via drill 0.33 pad 0.69)
  Top 0.203: v24.28,9.94 24.67,10.25 | 24.67,10.25 24.69,10.27 arc-39 25.32,10.5 25.58,10.5 arc-17 25.87,10.46 27.04,10.11 arc17 27.32,10.07 27.74,10.07 arc-90 29.01,8.8 D1.A | 24.67,10.25 24.24,10.18 v24.28,9.94 | 24.67,10.25 24.51,9.85 v24.28,9.94
  Top 0.305: D1.A 29.01,6.76 Q5.3
  Bottom 0.203: R7.P$1 23.67,9.23 arc-28 23.97,9.15 arc28 24.25,9.08 U$1.VBUS 24.38,9.08 24.38,9.45 | 24.38,9.45 24.38,9.65 arc39 v24.28,9.94 | 24.38,9.45 24.51,9.87 v24.28,9.94 | 24.38,9.45 24.1,9.78 v24.28,9.94
VCC  (via drill 0.33 pad 0.69)
  Top 0.203: IC5.3 9.96,14.33 10.03,14.26 | C12.P$2 14.52,17.31 arc-90 14.78,17.05 IC4.24 | C14.P$2 13.21,9.15 IC4.36 12.06,9.22 IC5.8 | R5.P$2 R9.P$2 22.56,17.19 arc-52 22.32,16.69 22.04,16.47 arc16 21.92,16.34 21.08,15.19 arc36 20.95,14.81 20.95,13.22 IC4.9 22.23,13.22 arc45 22.41,13.3 22.74,13.63 arc-45 22.92,13.7 C13.P$2 | SJ1.2 22.17,7.6 22.12,7.4 22.13,7 arc-67 21.94,6.71 21.73,6.62 arc-24 21.22,6.51 C15.P$2 20.53,6.72 arc34 20.47,6.89 20.33,7.11 arc-34 20.28,7.29 IC4.48 | v6.22,14.64 6.22,14.14 | 6.22,14.14 6.22,12.24 arc-45 5.85,11.35 5.2,10.69 arc-45 4.3,10.32 2.69,10.32 arc-45 1.79,10.69 1.63,10.85 arc-45 1.27,11.72 | 1.27,11.72 1.27,12.42 arc-90 1.59,12.73 R4.P$2 | R6.P$2 1.27,11.72 | LED2.A 23.88,3.21 23.88,6.98 IC3.2 | 6.22,14.14 6.43,14.52 v6.22,14.64 | 6.22,14.14 6.01,14.52 v6.22,14.64
  Top 0.305: 10.03,13.61 10.03,14.26 10.03,14.98 arc-45 10.17,15.31 11.12,16.26 arc-45 11.69,16.5 R14.P$2 13.02,16.5 | 10.03,13.61 v10.03,13.11 | 20.95,11.21 20.95,9.59 arc45 21.03,9.41 21.15,9.3 arc45 21.33,9.22 IC4.1 22.31,9.22 22.31,8.67 | 20.95,11.21 20.95,13.22 | SJ1.2 22.31,8.67 | v11.94,12.35 11.94,11.86 | 11.94,11.86 IC5.8 IC5.7 10.67,7.62 10.53,7.48 | FB1.P$1 5.21,14.32 arc-90 5.52,14.64 5.73,14.64 | 5.73,14.64 v6.22,14.64 | v20.45,11.21 20.94,11.21 | 20.94,11.21 20.95,11.21 | IC3.2 23.69,7.1 C7.P$2 23.69,8.67 22.31,8.67 | 13.02,16.5 13.03,16.5 | 13.03,16.5 13.04,16.5 | 13.04,16.5 13.71,17.17 arc-45 14.03,17.31 C12.P$2 | v13.21,16.04 13.03,16.5 | C17.P$1 10.53,7.48 | 10.53,7.48 8.44,7.48 arc-18 8.05,7.54 7.78,7.63 | 7.78,7.63 U$2.P$1 | 13.02,16.5 13.02,16.04 v13.21,16.04 | 13.02,16.5 13.34,16.17 v13.21,16.04 | 13.04,16.5 13.02,16.04 v13.21,16.04 | 13.04,16.5 13.35,16.16 v13.21,16.04 | 10.03,13.61 9.86,13.19 v10.03,13.11 | 10.03,13.61 10.21,13.19 v10.03,13.11 | 11.94,11.86 12.11,12.28 v11.94,12.35 | 11.94,11.86 11.76,12.28 v11.94,12.35 | 5.73,14.64 6.15,14.46 v6.22,14.64 | 5.73,14.64 6.15,14.81 v6.22,14.64 | 20.94,11.21 20.52,11.39 v20.45,11.21 | 20.94,11.21 20.52,11.03 v20.45,11.21 | 7.78,7.63 7.43,8.09 U$2.P$1 | 7.78,7.63 7.23,7.46 U$2.P$1
  Bottom 0.203: C10.P$1 11.79,18.15 arc-31 11.72,17.91 arc31 11.63,17.58 IC6.16 11.63,16.67 arc90 11.88,16.42 12.11,16.42 arc-23 12.51,16.34 12.75,16.23 | 12.75,16.23 v13.21,16.04 | LED1.A 5.21,15.21 arc90 5.52,14.89 5.8,14.89 | 5.8,14.89 6.22,14.89 | 14.22,12.35 14.84,11.74 arc45 15.74,11.36 FB2.P$1 | U$2.P$1 6.41,7.84 1.71,7.84 3V3.1 | R3.P$1 20.6,10.74 | 20.6,10.74 20.45,10.89 v20.45,11.21 | 12.75,16.23 13.02,15.89 v13.21,16.04 | 12.75,16.23 13.18,16.28 v13.21,16.04 | 5.8,14.89 6.01,14.52 v6.22,14.64 6.23,14.88 5.8,14.89 | 20.6,10.74 20.68,11.16 v20.45,11.21 | 20.6,10.74 20.28,11.03 v20.45,11.21
  Bottom 0.305: C9.P$2 11.54,10.33 arc45 11.63,10.55 IC6.5 11.63,11.97 | 6.65,14.89 6.22,14.89 v6.22,14.64 | 6.65,14.89 6.87,14.89 arc-32 7.55,14.69 v10.03,13.11 | 11.63,11.97 11.63,12.36 | 11.63,12.36 10.48,12.9 | 10.48,12.9 v10.03,13.11 | 11.63,12.36 v11.94,12.35 | v11.94,12.35 12.43,12.35 | 12.43,12.35 14.22,12.35 | C16.P$1 8.02,8.11 arc19 7.78,8.07 | 7.78,8.07 arc1 7.77,8.07 U$2.P$1 | FB2.P$1 16.86,11.36 18.03,11.21 19.95,11.21 | 19.95,11.21 v20.45,11.21 | v10.03,13.11 9.88,13.01 9.62,13.38 10.07,13.3 v10.03,13.11 | 10.48,12.9 10.18,13.24 v10.03,13.11 | 10.48,12.9 10.02,12.92 v10.03,13.11 | 11.63,11.97 12.03,12.19 v11.94,12.35 | 11.63,11.97 11.75,12.41 v11.94,12.35 | v11.94,12.35 11.83,12.19 11.45,12.44 11.9,12.54 v11.94,12.35 | 12.43,12.35 12.01,12.53 v11.94,12.35 | 12.43,12.35 12.01,12.18 v11.94,12.35 | 6.65,14.89 6.2,14.83 v6.22,14.64 | 6.65,14.89 6.38,14.53 v6.22,14.64 | 19.95,11.21 20.37,11.03 v20.45,11.21 | 19.95,11.21 20.37,11.39 v20.45,11.21 | 7.78,8.07 7.22,8.23 U$2.P$1 | 7.78,8.07 7.43,7.61 U$2.P$1
  Bottom 0.406: 6.41,7.84 6.94,7.54 U$2.P$1 6.94,8.15 6.41,7.84

### Text on the board
_tPlace: BIND | PPM | V0.2 | - | 4+ | 3+ | 2+ | 1+ | +
_tNames: SWCLK | SWDIO | C12 | R5 | R14 | R9 | PPM | FB1 | C13 | R4 | C8 | Y1 | R6 | IC4 | IC5 | C7 | D1 | C17 | C14 | R16 | R15 | C15 | SJ1 | Q5 | SWCLK | SWDIO | IC3 | M2+ | M1+ | M3+ | M4+ | LED2
_bNames: C10 | R12 | C5 | LED1 | R13 | C3 | C2 | IC1 | IC6 | IC2 | TX/SCL | C1 | C6 | U$1 | RX/SDA | FB2 | C4 | R8 | C16 | GND | R11 | C9 | C11 | R10 | R3 | R7 | R2 | 3V3 | C19 | R1 | C18 | R20 | Q4 | R18 | Q2 | R19 | Q3 | R17 | Q1 | JP1 | M4- | M3- | M2- | M1-
_tValues: 0u1 | 10k | DNP | 10k | 8MHZ | 2k2 | 0u1 | 47n | 2k2 | M25P16 | STM32F103CBT6 | u47 | XC6206P332 | 0u1 | 0u1 | AO3401 | BAT54 | 680 | 1k | 0u1 | BOOT
_bValues: u1 | 510 | 2n2 50v | 510 | 47n | u47 | microUSB | u47 | 47n | STM32F030F4T6 | 0u1 | 15k | 680 | u1 | 47n | 1k | 0u1 | 10k | 22 | 1k5 | 22 | MS5611 | BAT | Si2312 | Si2312 | Si2312 | Si2312 | 2u2 | 10k | 10k | 2u2 | 10k | 10k